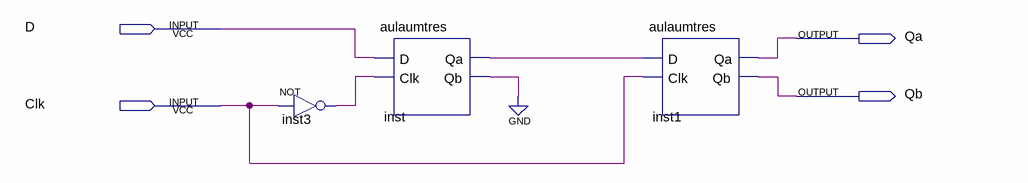
[diagram p0: schematic sheet]
// Quartus schematic aulaumtresff.bdf as structural Verilog: 3 symbols, 4 pins
module aulaumtresff (
  input  D,
  input  Clk,
  output Qa,
  output Qb
);

  wire inst3_out, inst_qa, inst_qb;

  not inst3 (inst3_out, Clk);
  aulaumtres inst (.D(D), .Clk(inst3_out), .Qa(inst_qa), .Qb(inst_qb));
  aulaumtres inst1 (.D(inst_qa), .Clk(Clk), .Qa(Qa), .Qb(Qb));
  // also tied to GND on the sheet: inst_qb
endmodule
